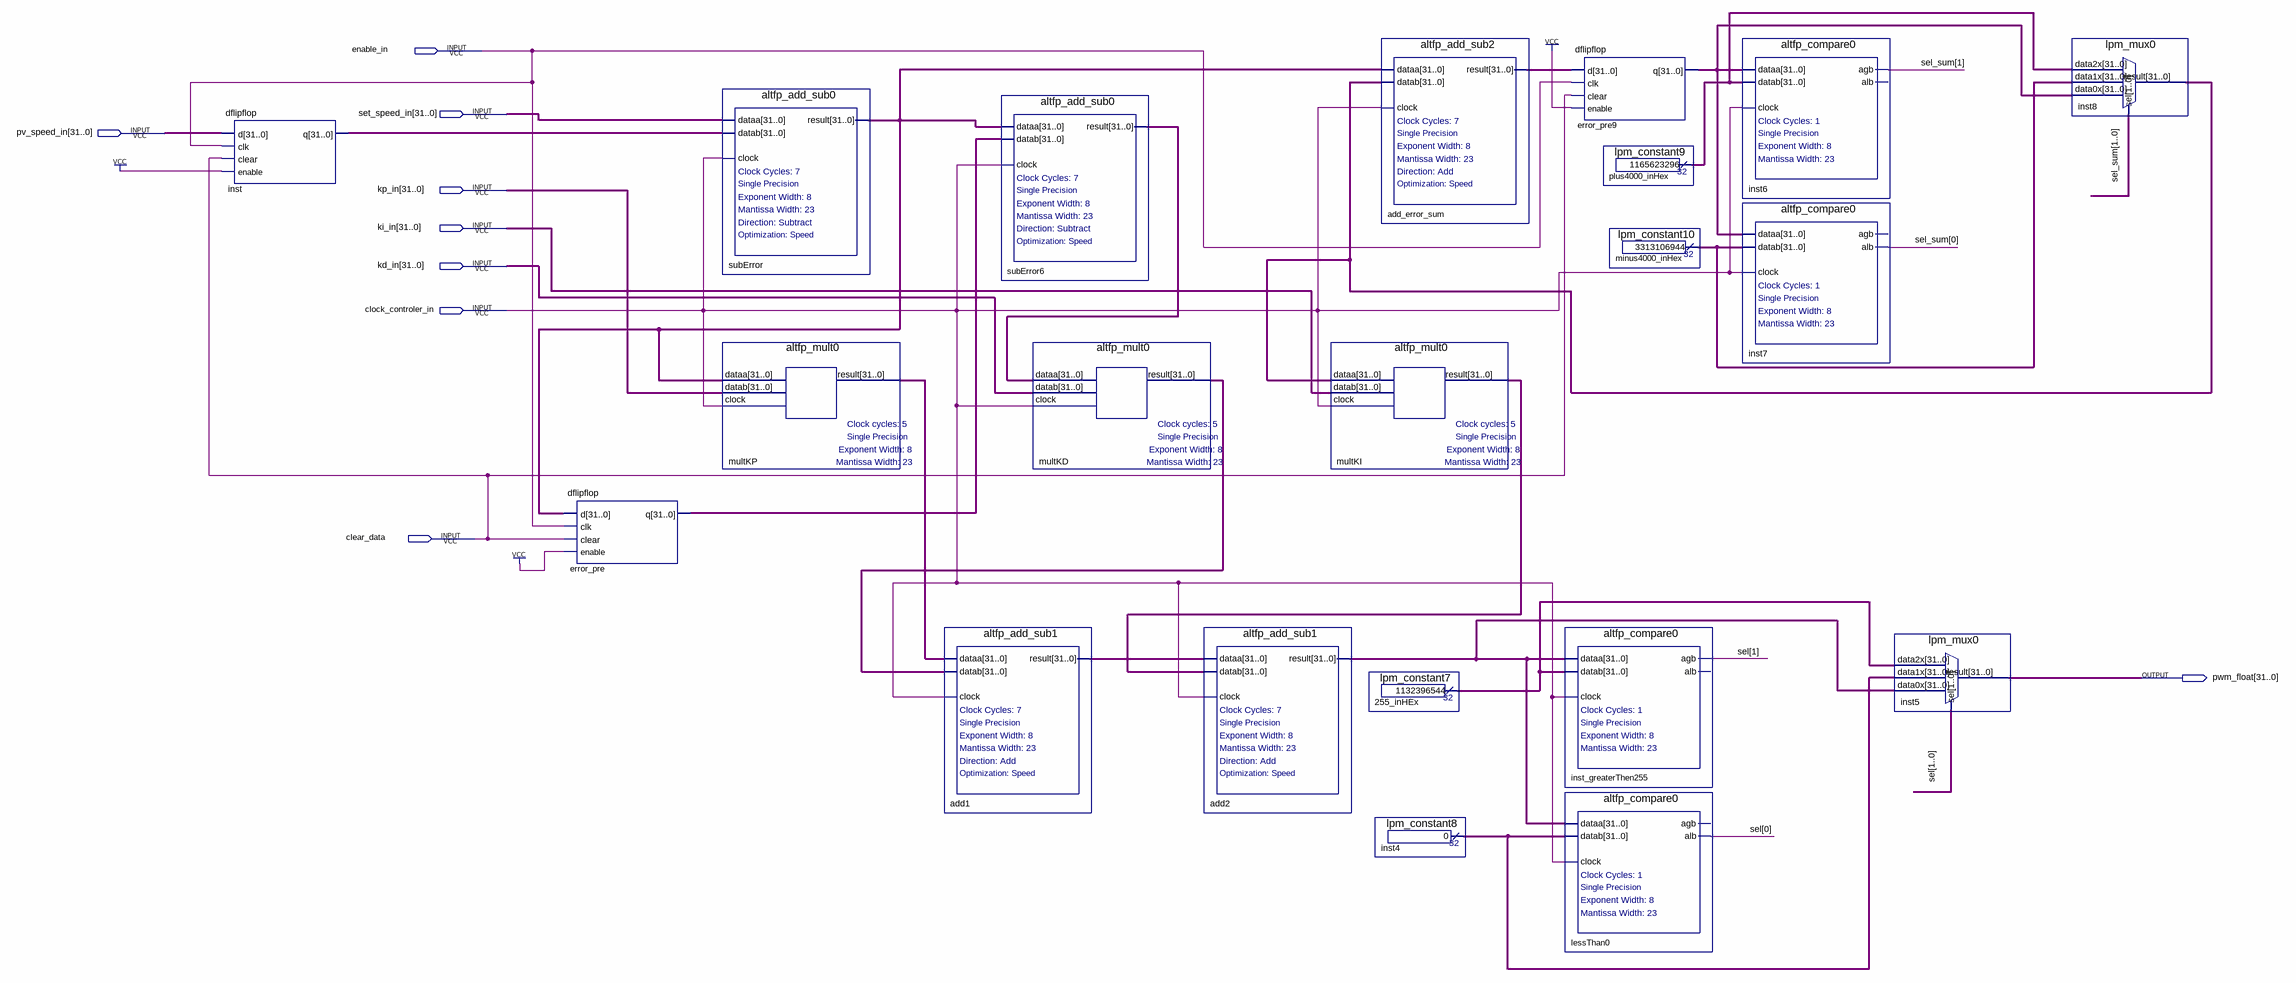
[diagram p0: schematic sheet]
// Quartus schematic controller_block.bdf as structural Verilog: 21 symbols, 9 pins
module controller_block (
  input  enable_in,
  input  [31:0] set_speed_in,
  input  [31:0] pv_speed_in,
  input  [31:0] kp_in,
  input  [31:0] ki_in,
  input  [31:0] kd_in,
  input  clock_controler_in,
  input  clear_data,
  output [31:0] pwm_float
);

  wire [1:0] sel, sel_sum;
  wire [31:0] add1_result, add2_result, add_error_sum_result, error_pre9_q, error_pre_q, inst4_result,
       inst8_result, inst_q, minus4000_inHex_result, multKD_result, multKI_result, multKP_result,
       n255_inHEx_result, plus4000_inHex_result, subError6_result, subError_result;

  dflipflop inst (.d(pv_speed_in), .clk(enable_in), .clear(clear_data), .enable(1'b1), .q(inst_q));
  dflipflop error_pre (.d(subError_result), .clk(enable_in), .clear(clear_data), .enable(1'b1), .q(error_pre_q));
  altfp_add_sub0 subError (.dataa(set_speed_in), .datab(inst_q), .clock(clock_controler_in), .result(subError_result));
  altfp_mult0 multKP (.dataa(subError_result), .datab(kp_in), .clock(clock_controler_in), .result(multKP_result));
  altfp_add_sub1 add1 (.dataa(multKP_result), .datab(multKD_result), .clock(clock_controler_in), .result(add1_result));
  altfp_add_sub0 subError6 (
    .dataa(subError_result), .datab(error_pre_q), .clock(clock_controler_in), .result(subError6_result));
  altfp_mult0 multKD (.dataa(subError6_result), .datab(kd_in), .clock(clock_controler_in), .result(multKD_result));
  altfp_add_sub1 add2 (.dataa(add1_result), .datab(multKI_result), .clock(clock_controler_in), .result(add2_result));
  altfp_mult0 multKI (.dataa(inst8_result), .datab(ki_in), .clock(clock_controler_in), .result(multKI_result));
  altfp_add_sub2 add_error_sum (
    .dataa(subError_result), .datab(inst8_result), .clock(clock_controler_in), .result(add_error_sum_result));
  lpm_constant7 u_255_inHEx (.result(n255_inHEx_result));
  lpm_constant8 inst4 (.result(inst4_result));
  dflipflop error_pre9 (.d(add_error_sum_result), .clk(enable_in), .clear(clear_data), .enable(1'b1), .q(error_pre9_q));
  lpm_constant9 plus4000_inHex (.result(plus4000_inHex_result));
  altfp_compare0 inst_greaterThen255 (
    .dataa(add2_result), .datab(n255_inHEx_result), .clock(clock_controler_in), .agb(sel[1]));  // open: alb
  altfp_compare0 lessThan0 (
    .dataa(add2_result), .datab(inst4_result), .clock(clock_controler_in), .alb(sel[0]));  // open: agb
  lpm_constant10 minus4000_inHex (.result(minus4000_inHex_result));
  altfp_compare0 inst6 (
    .dataa(error_pre9_q), .datab(plus4000_inHex_result), .clock(clock_controler_in), .agb(sel_sum[1]));  // open: alb
  altfp_compare0 inst7 (
    .dataa(error_pre9_q), .datab(minus4000_inHex_result), .clock(clock_controler_in), .alb(sel_sum[0]));  // open: agb
  lpm_mux0 inst5 (
    .data2x(n255_inHEx_result), .data1x(inst4_result), .data0x(add2_result), .sel(sel), .result(pwm_float));
  lpm_mux0 inst8 (
    .data2x(plus4000_inHex_result), .data1x(minus4000_inHex_result), .data0x(error_pre9_q), .sel(sel_sum),
    .result(inst8_result));
endmodule
